# Altium schematic sheet Drone _Schematic_STM32_MCU_for_altium.schdoc
size 436 x 293 mm
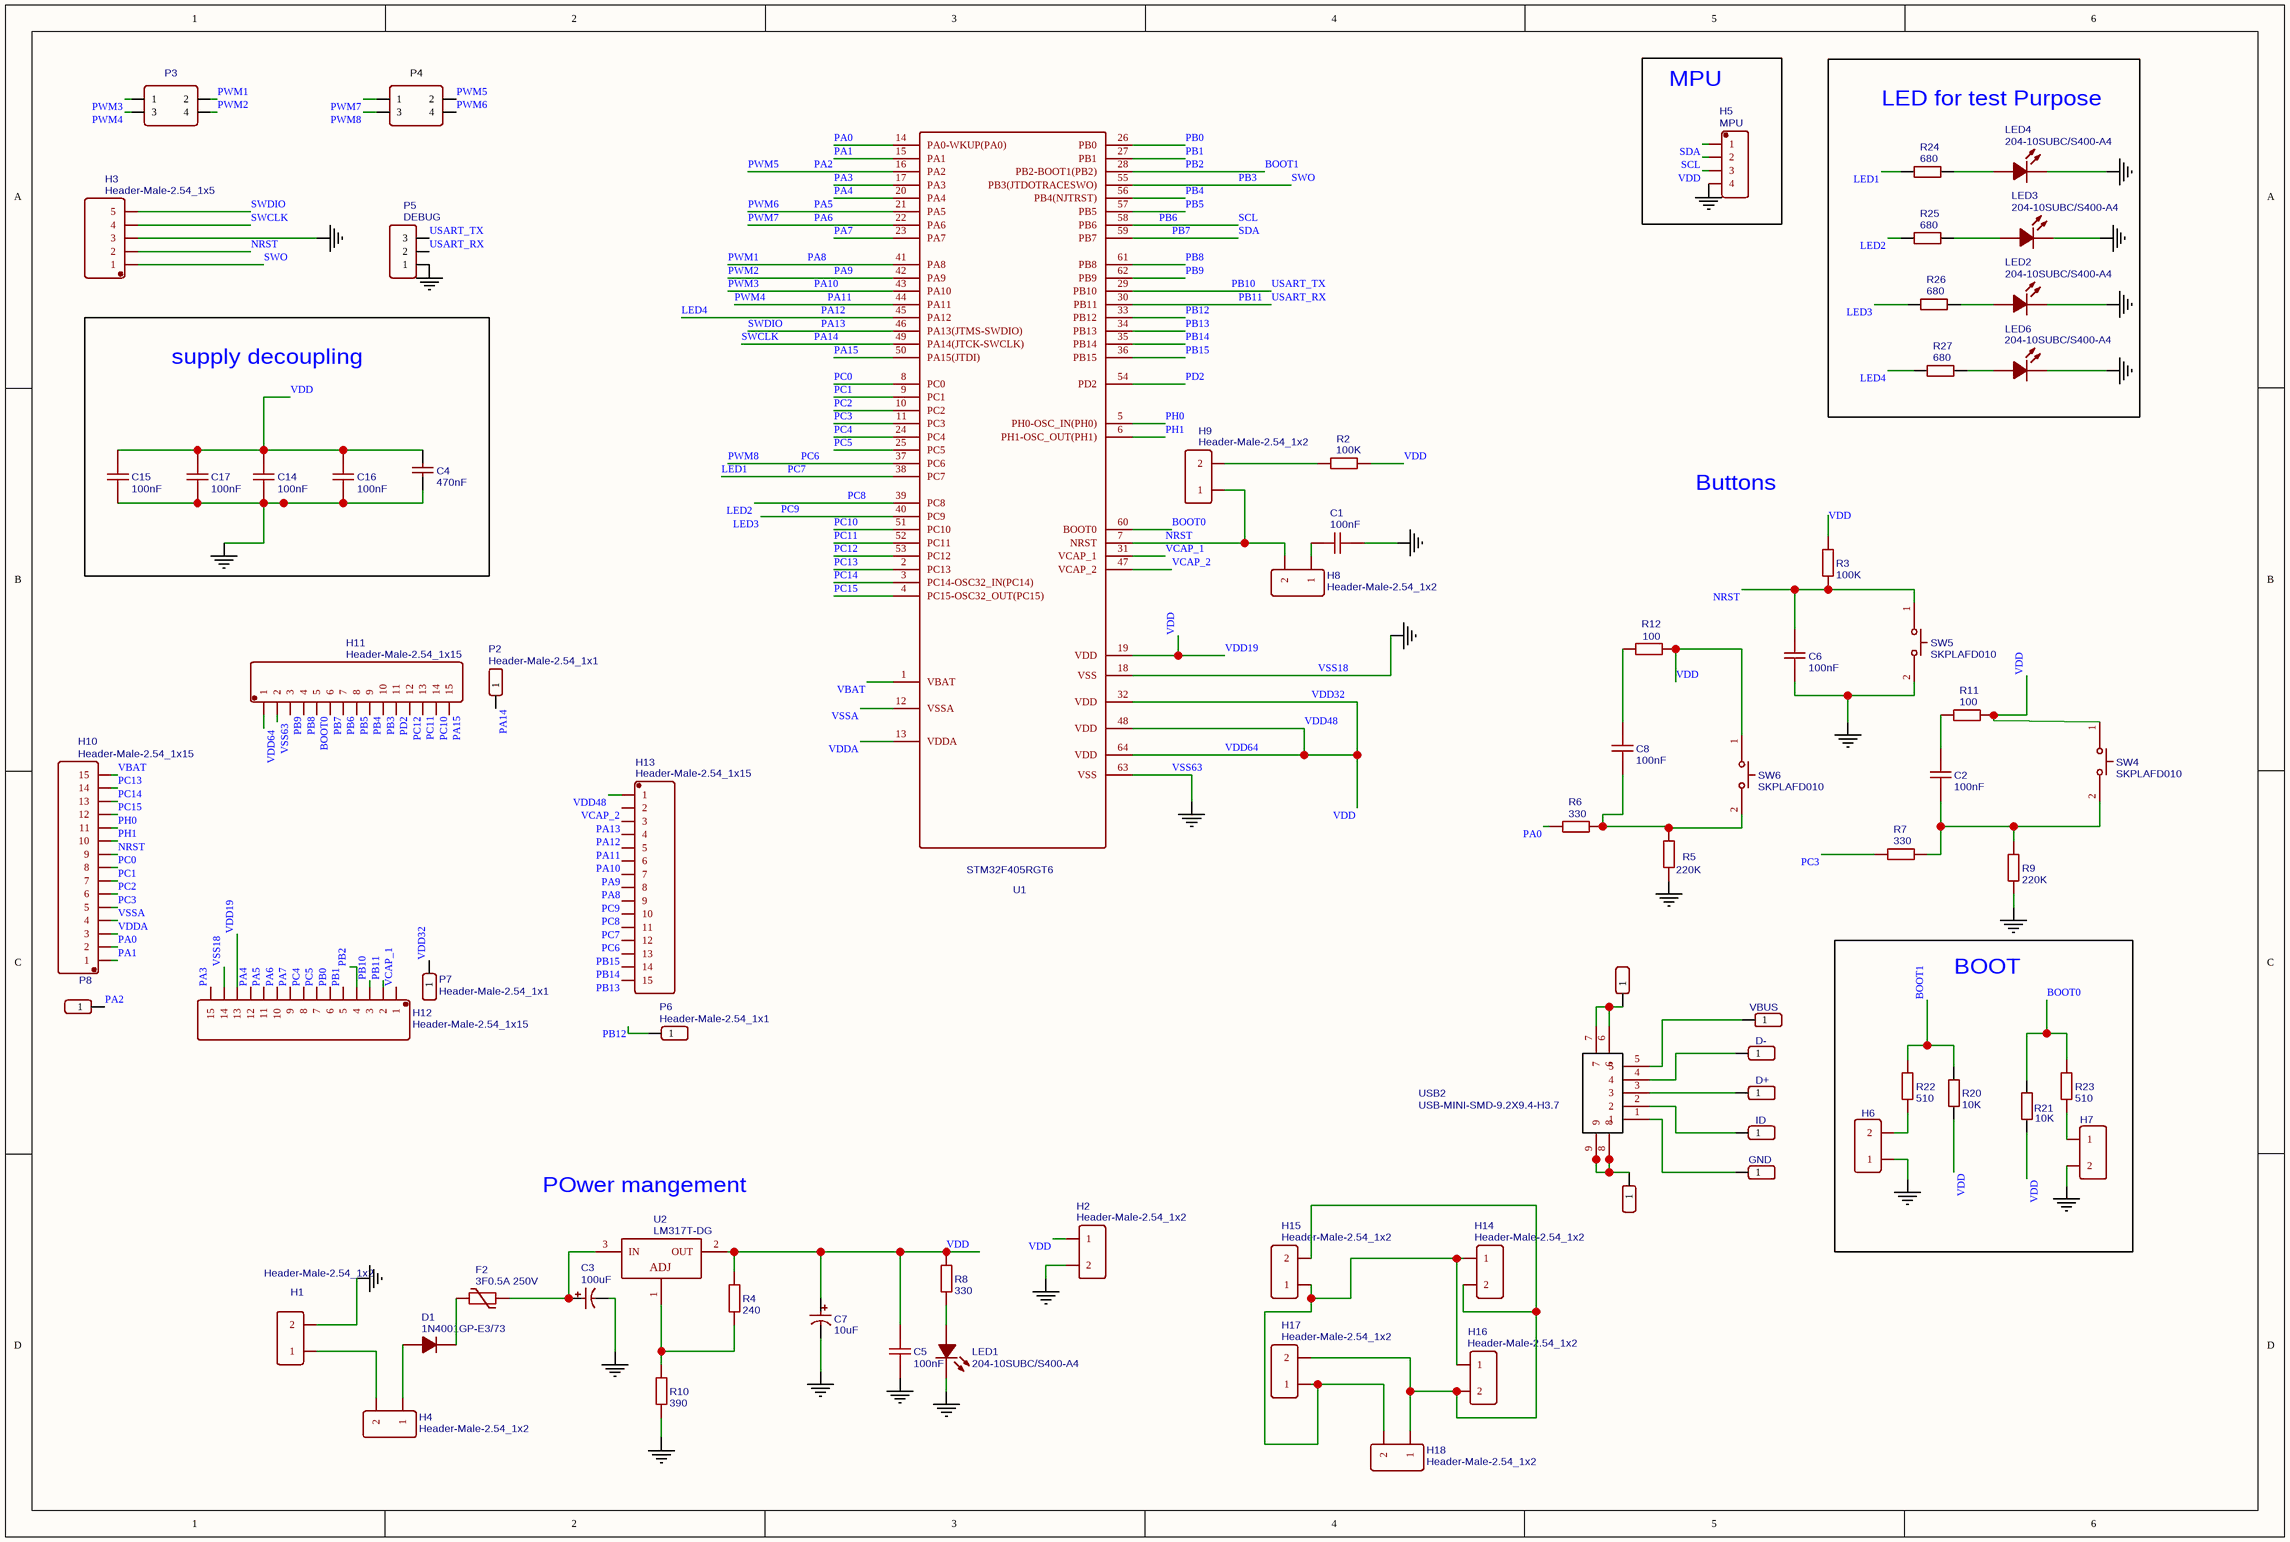
[diagram p0: Drone _Schematic_STM32_MCU_for_altium.schdoc]

## Parts
C1  100nF  [CAP-CT4G-0805-2.54MM]
C2  100nF  [CAP-CT4G-0805-2.54MM]
C3  100uF  [CAP-D6.3XF2.5]
C4  470nF  [CAP-4.2*3.8-5.08]
C5  100nF  [CAP-CT4G-0805-2.54MM]
C6  100nF  [CAP-CT4G-0805-2.54MM]
C7  10uF  [CAP-D4.0XF1.5]
C8  100nF  [CAP-CT4G-0805-2.54MM]
C14  100nF  [CAP-CT4G-0805-2.54MM]
C15  100nF  [CAP-CT4G-0805-2.54MM]
C16  100nF  [CAP-CT4G-0805-2.54MM]
C17  100nF  [CAP-CT4G-0805-2.54MM]
D1  1N4001GP-E3/73  [DO-41]
D+  Header-Male-2.54_1x1  [HDR-1X1/2.54]  (value not drawn)
D-  Header-Male-2.54_1x1  [HDR-1X1/2.54]  (value not drawn)
F2  3F0.5A 250V  [3.6*10]
GND  Header-Male-2.54_1x1  [HDR-1X1/2.54]  (value not drawn)
H1  Header-Male-2.54_1x2  [HDR-2X1/2.54]
H2  Header-Male-2.54_1x2  [HDR-2X1/2.54]
H3  Header-Male-2.54_1x5  [DIP-1X5P-2.54MM-M]
H4  Header-Male-2.54_1x2  [HDR-2X1/2.54]
H5  MPU  [DIP-1X4P-2.54MM-M]
H6  Header-Male-2.54_1x2  [HDR-2X1/2.54]  (value not drawn)
H7  Header-Male-2.54_1x2  [HDR-2X1/2.54]  (value not drawn)
H8  Header-Male-2.54_1x2  [HDR-2X1/2.54]
H9  Header-Male-2.54_1x2  [HDR-2X1/2.54]
H10  Header-Male-2.54_1x15  [DIP-1X15P-2.54MM-M]
H11  Header-Male-2.54_1x15  [DIP-1X15P-2.54MM-M]
H12  Header-Male-2.54_1x15  [DIP-1X15P-2.54MM-M]
H13  Header-Male-2.54_1x15  [DIP-1X15P-2.54MM-M]
H14  Header-Male-2.54_1x2  [HDR-2X1/2.54]
H15  Header-Male-2.54_1x2  [HDR-2X1/2.54]
H16  Header-Male-2.54_1x2  [HDR-2X1/2.54]
H17  Header-Male-2.54_1x2  [HDR-2X1/2.54]
H18  Header-Male-2.54_1x2  [HDR-2X1/2.54]
ID  Header-Male-2.54_1x1  [HDR-1X1/2.54]  (value not drawn)
LED1  204-10SUBC/S400-A4  [LED-3MM]
LED2  204-10SUBC/S400-A4  [LED-3MM]
LED3  204-10SUBC/S400-A4  [LED-3MM]
LED4  204-10SUBC/S400-A4  [LED-3MM]
LED6  204-10SUBC/S400-A4  [LED-3MM]
P2  Header-Male-2.54_1x1  [HDR-1X1/2.54]
P3  Header-Male-2.54_2x2  [HDR-2X2/2.54]  (value not drawn)
P4  Header-Male-2.54_2x2  [HDR-2X2/2.54]  (value not drawn)
P5  DEBUG  [HDR-3X1/2.54]
P6  Header-Male-2.54_1x1  [HDR-1X1/2.54]
P7  Header-Male-2.54_1x1  [HDR-1X1/2.54]
P8  Header-Male-2.54_1x1  [HDR-1X1/2.54]  (value not drawn)
P9  Header-Male-2.54_1x1  [HDR-1X1/2.54]  (value not drawn)
P10  Header-Male-2.54_1x1  [HDR-1X1/2.54]  (value not drawn)
R2  100K  [AXIAL-0.3]
R3  100K  [AXIAL-0.3]
R4  240  [AXIAL-0.3]
R5  220K  [AXIAL-0.4]
R6  330  [AXIAL-0.4]
R7  330  [AXIAL-0.4]
R8  330  [AXIAL-0.4]
R9  220K  [AXIAL-0.4]
R10  390  [AXIAL-0.4]
R11  100  [AXIAL-0.4]
R12  100  [AXIAL-0.4]
R20  10K  [AXIAL-0.4]
R21  10K  [AXIAL-0.4]
R22  510  [AXIAL-0.4]
R23  510  [AXIAL-0.4]
R24  680  [AXIAL-0.4]
R25  680  [AXIAL-0.4]
R26  680  [AXIAL-0.4]
R27  680  [AXIAL-0.4]
SW4  SKPLAFD010  [SW-DIP-6.45X5]
SW5  SKPLAFD010  [SW-DIP-6.45X5]
SW6  SKPLAFD010  [SW-DIP-6.45X5]
U1  STM32F405RGT6  [LQFP-64_10X10X05P]
U2  LM317T-DG  [TO-220(TO-220-3)]
USB2  USB-MINI-SMD-9.2X9.4-H3.7  [USB-MINI-SMD-9.4X9.2-H3.7]
VBUS  Header-Male-2.54_1x1  [HDR-1X1/2.54]  (value not drawn)

## Blocks framed on the sheet
MPU: H5
LED for test Purpose: LED2-LED4 LED6 R24-R27
supply decoupling: C4 C14-C17
BOOT: H6 H7 R20-R23

## Nets
VSS18: C1.1 C3.2 C4.1 C5.1 C6.2 C7.2 C14.1 C15.1 C16.1 C17.1 H1.2 H2.2 H3.3 H5.4 H6.1 H7.2 H11.2 H12.14 LED1.2(K) LED2.2(K) LED3.2(K) LED4.2(K) LED6.2(K) P5.1 R5.1 R9.1 R10.1 SW5.2 U1.18(VSS) U1.63(VSS)  [also labelled GND, VSS63]
BOOT0: H11.5 R21.2 R23.2 U1.60(BOOT0)
BOOT1: H12.4 R20.2 R22.2 U1.28(PB2-BOOT1(PB2))  [also labelled PB2]
LED1: H13.11 R24.1 U1.38(PC7)  [also labelled PC7]
LED2: H13.10 R25.1 U1.39(PC8)  [also labelled PC8]
LED3: H13.9 R26.1 U1.40(PC9)  [also labelled PC9]
LED4: H13.4 R27.1 U1.45(PA12)  [also labelled PA12]
NRST: C6.1 H3.2 H8.2 H9.1 H10.9 R3.1 SW5.1 U1.7(NRST)
PA0: H10.2 R6.1 U1.14(PA0-WKUP(PA0))
PA1: H10.1 U1.15(PA1)
PA2: P4.2 P8.1 U1.16(PA2)  [also labelled PWM5]
PA3: H12.15 U1.17(PA3)
PA4: H12.12 U1.20(PA4)
PA5: H12.11 P4.4 U1.21(PA5)  [also labelled PWM6]
PA6: H12.10 P4.1 U1.22(PA6)  [also labelled PWM7]
PA7: H12.9 U1.23(PA7)
PA8: H13.8 P3.2 U1.41(PA8)  [also labelled PWM1]
PA9: H13.7 P3.4 U1.42(PA9)  [also labelled PWM2]
PA10: H13.6 P3.1 U1.43(PA10)  [also labelled PWM3]
PA11: H13.5 P3.3 U1.44(PA11)  [also labelled PWM4]
PA13: H3.5 H13.3 U1.46(PA13(JTMS-SWDIO))  [also labelled SWDIO]
PA14: H3.4 P2.1 U1.49(PA14(JTCK-SWCLK))  [also labelled SWCLK]
PA15: H11.15 U1.50(PA15(JTDI))
PB0: H12.6 U1.26(PB0)
PB1: H12.5 U1.27(PB1)
PB3: H3.1 H11.10 U1.55(PB3(JTDOTRACESWO))  [also labelled SWO]
PB4: H11.9 U1.56(PB4(NJTRST))
PB5: H11.8 U1.57(PB5)
PB6: H5.2 H11.7 U1.58(PB6)  [also labelled SCL]
PB7: H5.1 H11.6 U1.59(PB7)  [also labelled SDA]
PB8: H11.4 U1.61(PB8)
PB9: H11.3 U1.62(PB9)
PB10: H12.3 P5.3 U1.29(PB10)  [also labelled USART_TX]
PB11: H12.2 P5.2 U1.30(PB11)  [also labelled USART_RX]
PB12: P6.1 U1.33(PB12)
PB13: H13.15 U1.34(PB13)
PB14: H13.14 U1.35(PB14)
PB15: H13.13 U1.36(PB15)
PC0: H10.8 U1.8(PC0)
PC1: H10.7 U1.9(PC1)
PC2: H10.6 U1.10(PC2)
PC3: H10.5 R7.1 U1.11(PC3)
PC4: H12.8 U1.24(PC4)
PC5: H12.7 U1.25(PC5)
PC6: H13.12 P4.3 U1.37(PC6)  [also labelled PWM8]
PC10: H11.14 U1.51(PC10)
PC11: H11.13 U1.52(PC11)
PC12: H11.12 U1.53(PC12)
PC13: H10.14 U1.2(PC13)
PC14: H10.13 U1.3(PC14-OSC32_IN(PC14))
PC15: H10.12 U1.4(PC15-OSC32_OUT(PC15))
PD2: H11.11 U1.54(PD2)
PH0: H10.11 U1.5(PH0-OSC_IN(PH0))
PH1: H10.10 U1.6(PH1-OSC_OUT(PH1))
VBAT: H10.15 U1.1(VBAT)
VCAP_1: H12.1 U1.31(VCAP_1)
VCAP_2: H13.2 U1.47(VCAP_2)
VDD: C4.2 C5.2 C7.1 C14.2 C15.2 C16.2 C17.2 H2.1 H5.3 H11.1 H12.13 H13.1 P7.1 R2.2 R3.2 R4.2 R8.2 R11.2 R12.2 R20.1 R21.1 SW4.1 SW6.1 U1.19(VDD) U1.32(VDD) U1.48(VDD) U1.64(VDD) U2.2(OUT)  [also labelled VDD19, VDD32, VDD48, VDD64]
VDDA: H10.3 U1.13(VDDA)
VSSA: H10.4 U1.12(VSSA)
NetC1_2: C1.2 H8.1
NetC2_1: C2.1 R11.1
NetC2_2: C2.2 R7.2 R9.2 SW4.2
NetC3_1: C3.1 F2.2 U2.3(IN)
NetC8_1: C8.1 R12.1
NetC8_2: C8.2 R5.2 R6.2 SW6.2
NetD1_1: D1.1(A) H4.1
NetD1_2: D1.2(K) F2.1
NetD+_1: D+.1 USB2.3
NetD-_1: D-.1 USB2.4
NetGND_1: GND.1 USB2.1
NetH1_1: H1.1 H4.2
NetH6_2: H6.2 R22.1
NetH7_1: H7.1 R23.1
NetH9_2: H9.2 R2.1
NetH14_1: H14.1 H15.1 H16.1 H17.1 H18.2
NetH14_2: H14.2 H15.2 H16.2 H17.2 H18.1
NetID_1: ID.1 USB2.2
NetLED1_1: LED1.1(A) R8.1
NetLED2_1: LED2.1(A) R26.2
NetLED3_1: LED3.1(A) R25.2
NetLED4_1: LED4.1(A) R24.2
NetLED6_1: LED6.1(A) R27.2
NetP9_1: P9.1 USB2.6 USB2.7
NetP10_1: P10.1 USB2.8 USB2.9
NetR4_1: R4.1 R10.2 U2.1(ADJ)
NetUSB2_5: USB2.5 VBUS.1

## Notes on the sheet
- Buttons
- POwer mangement

## Library data of the parts
C1 C2 C5 C6 C8 C14-C17 = 100nF: BOM_Manufacturer: Dersonic; BOM_Manufacturer Part: CC1H104ZA19D3F5P10MF; nameAlias: Capacitance; Contributor: LCSC; BOM_Supplier: LCSC; BOM_Supplier Part: C254086; spicePre: C; spiceSymbolName: CC1H104ZA19D3F5P10MF
C3 = 100uF: BOM_Manufacturer: ValuePro; BOM_Manufacturer Part: 100uF 16V 6.3*5; nameAlias: Capacitance; BOM_Supplier: LCSC; BOM_Supplier Part: C43804; spicePre: C; spiceSymbolName: 100uF 16V 6.3*5
C4 = 470nF: BOM_Manufacturer: NCC; BOM_Manufacturer Part: KTD101B474M32A0B00; nameAlias: Capacitance; BOM_Supplier: LCSC; BOM_Supplier Part: C133472; spicePre: C; spiceSymbolName: KTD101B474M32A0B00
C7 = 10uF: BOM_Manufacturer: ValuePro; BOM_Manufacturer Part: 10uF 25V 4*7; nameAlias: Capacitance; BOM_Supplier: LCSC; BOM_Supplier Part: C43351; spicePre: C; spiceSymbolName: 10uF 25V 4*7
D1 = 1N4001GP-E3/73: BOM_Manufacturer: VISHAY; Contributor: LCSC; BOM_Supplier: LCSC; BOM_Manufacturer Part: 1N4001GP-E3/73; BOM_Supplier Part: C145246; spicePre: D
D+ D- GND ID P2 P6-P10 VBUS = Header-Male-2.54_1x1: BOM_Manufacturer: ReliaPro; BOM_Supplier Part: C81276; BOM_Supplier: LCSC; BOM_Manufacturer Part: Header-Male-2.54_1x1; spicePre: P
F2 = 3F0.5A 250V: BOM_Manufacturer: XC Elec(Shenzhen); Contributor: LCSC; BOM_Supplier: LCSC; BOM_Supplier Part: C140490; BOM_Manufacturer Part: 3F0.5A 250V; spicePre: F
H1 H2 H4 H6-H9 H14-H18 = Header-Male-2.54_1x2: BOM_Manufacturer: TE Connectivity; BOM_Manufacturer Part: 826629-2; BOM_Supplier Part: C86471; BOM_Supplier: LCSC; image: //image.lceda.cn/szlcsc/C86471.jpg; spicePre: H
H3 = Header-Male-2.54_1x5: BOM_Manufacturer: Ckmtw; BOM_Manufacturer Part: 210S-1*5P L=11.6MMGold-plated black; Contributor: LCSC; BOM_Supplier: LCSC; BOM_Supplier Part: C124379; spicePre: H
H5 = MPU: BOM_Manufacturer: Ckmtw; BOM_Manufacturer Part: 210S-1*4P L=11.6MMGold-plated black; Contributor: LCSC; BOM_Supplier: LCSC; BOM_Supplier Part: C124378; spicePre: H
H10-H13 = Header-Male-2.54_1x15: BOM_Manufacturer: Ckmtw; BOM_Manufacturer Part: 210S-1*15P L=11.6MMGold-plated black; Contributor: LCSC; BOM_Supplier: LCSC; BOM_Supplier Part: C124373; spicePre: H
LED1-LED4 LED6 = 204-10SUBC/S400-A4: BOM_Manufacturer: EVERLIGHT; BOM_Supplier: LCSC; BOM_Manufacturer Part: 204-10SUBC/S400-A4; BOM_Supplier Part: C86881; spicePre: L
P3 P4 = Header-Male-2.54_2x2: BOM_Manufacturer: BOOMELE; BOM_Manufacturer Part: Double Rows2.54mm2*2pHeaders??Pins; BOM_Supplier: LCSC; BOM_Supplier Part: C66690; spicePre: P
P5 = DEBUG: BOM_Manufacturer: BOOMELE; BOM_Manufacturer Part: Header2.54mm 1*3P; BOM_Supplier: LCSC; image: //image.lceda.cn/szlcsc/C49257.jpg; BOM_Supplier Part: C49257; spicePre: P
R2 R3 = 100K: BOM_Manufacturer: FlyWin; nameAlias: Value; Contributor: LCSC; BOM_Supplier: LCSC; BOM_Supplier Part: C337031; BOM_Manufacturer Part: -; spicePre: R; spiceSymbolName: CR1/8W ±5% 100K STB5
R4 = 240: BOM_Manufacturer: Chian Chia Elec; nameAlias: Resistance (Ohms); Contributor: LCSC; BOM_Supplier: LCSC; BOM_Supplier Part: C119855; BOM_Manufacturer Part: -; spicePre: R; spiceSymbolName: CF1/6W-240Ω±5% T52
R5 R9 = 220K: BOM_Manufacturer: Chian Chia Elec; nameAlias: Resistance (Ohms); Contributor: LCSC; BOM_Supplier: LCSC; BOM_Supplier Part: C120111; BOM_Manufacturer Part: -; spicePre: R; spiceSymbolName: CF1/4W-220KΩ±5% T52
R6-R8 = 330: BOM_Manufacturer: Chian Chia Elec; nameAlias: Resistance (Ohms); Contributor: LCSC; BOM_Supplier: LCSC; BOM_Supplier Part: C120043; BOM_Manufacturer Part: -; spicePre: R; spiceSymbolName: CF1/4W-330Ω±5% T52
R10 = 390: BOM_Manufacturer: Chian Chia Elec; nameAlias: Resistance (Ohms); Contributor: LCSC; BOM_Supplier: LCSC; BOM_Supplier Part: C120045; BOM_Manufacturer Part: -; spicePre: R; spiceSymbolName: CF1/4W-390Ω±5% T52
R11 R12 = 100: BOM_Manufacturer: Chian Chia Elec; nameAlias: Resistance (Ohms); Contributor: LCSC; BOM_Supplier: LCSC; BOM_Supplier Part: C120031; BOM_Manufacturer Part: -; spicePre: R; spiceSymbolName: CF1/4W-100Ω±5% T52
R20 R21 = 10K: BOM_Manufacturer Part: CFR0W4J0103A50; BOM_Manufacturer: UniOhm; nameAlias: Resistance (Ohms); BOM_Supplier: LCSC; BOM_Supplier Part: C61299; spicePre: R; spiceSymbolName: CFR0W4J0103A50
R22 R23 = 510: BOM_Manufacturer: Chian Chia Elec; nameAlias: Resistance (Ohms); Contributor: LCSC; BOM_Supplier: LCSC; BOM_Supplier Part: C120048; BOM_Manufacturer Part: -; spicePre: R; spiceSymbolName: CF1/4W-510Ω±5% T52
R24-R27 = 680: BOM_Manufacturer: UniOhm; BOM_Manufacturer Part: CFR0W4J0681A50; nameAlias: Resistance (Ohms); BOM_Supplier: LCSC; BOM_Supplier Part: C70784; spicePre: R; spiceSymbolName: CFR0W4J0681A50
SW4-SW6 = SKPLAFD010: BOM_Manufacturer: ALPS Electric; Contributor: LCSC; BOM_Supplier: LCSC; BOM_Supplier Part: C139775; BOM_Manufacturer Part: SKPLAFD010; spicePre: S
U2 = LM317T-DG: BOM_Manufacturer: STMicroelectronics; BOM_Supplier: LCSC; BOM_Manufacturer Part: LM317T-DG; image: //image.lceda.cn/szlcsc/C18718.jpg; BOM_Supplier Part: C18718; spicePre: U
USB2 = USB-MINI-SMD-9.2X9.4-H3.7: BOM_Manufacturer: LCSC; BOM_Supplier: LCSC; BOM_Supplier Part: C105424; BOM_Manufacturer Part: USB-MINI-SMD-9.2X9.4-H3.7; Contributor: LCSC; spicePre: U